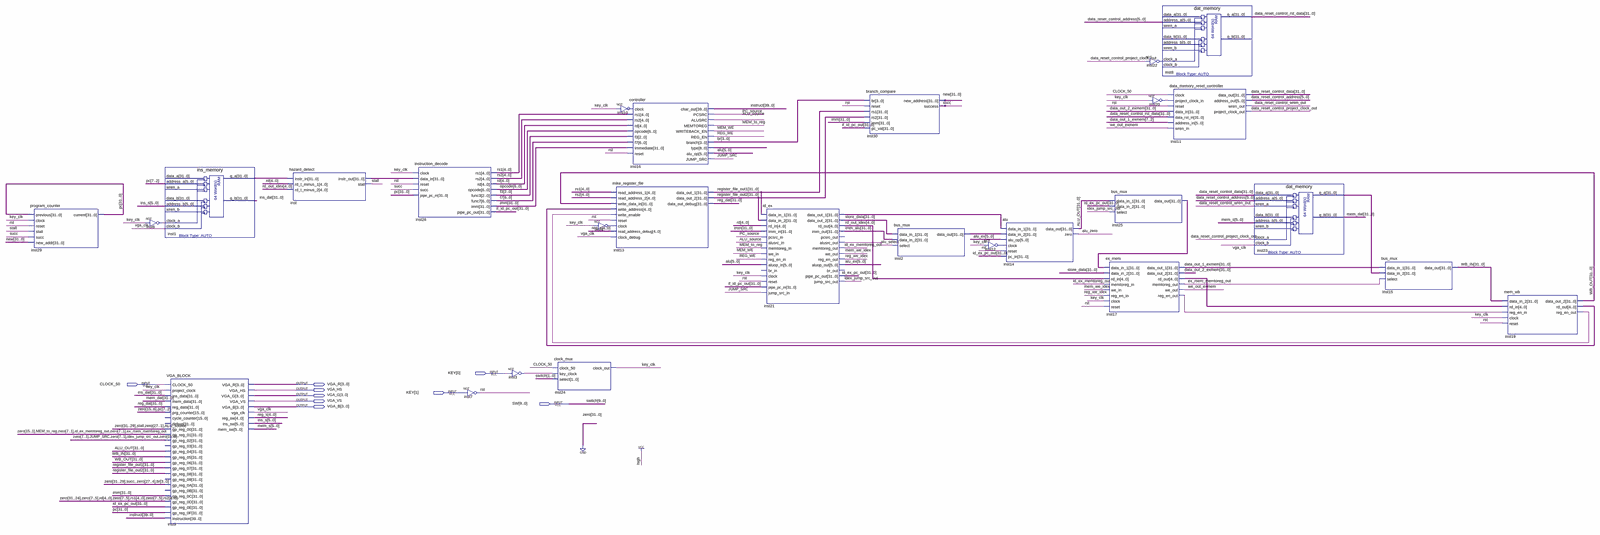
[diagram p0: schematic sheet, whole]
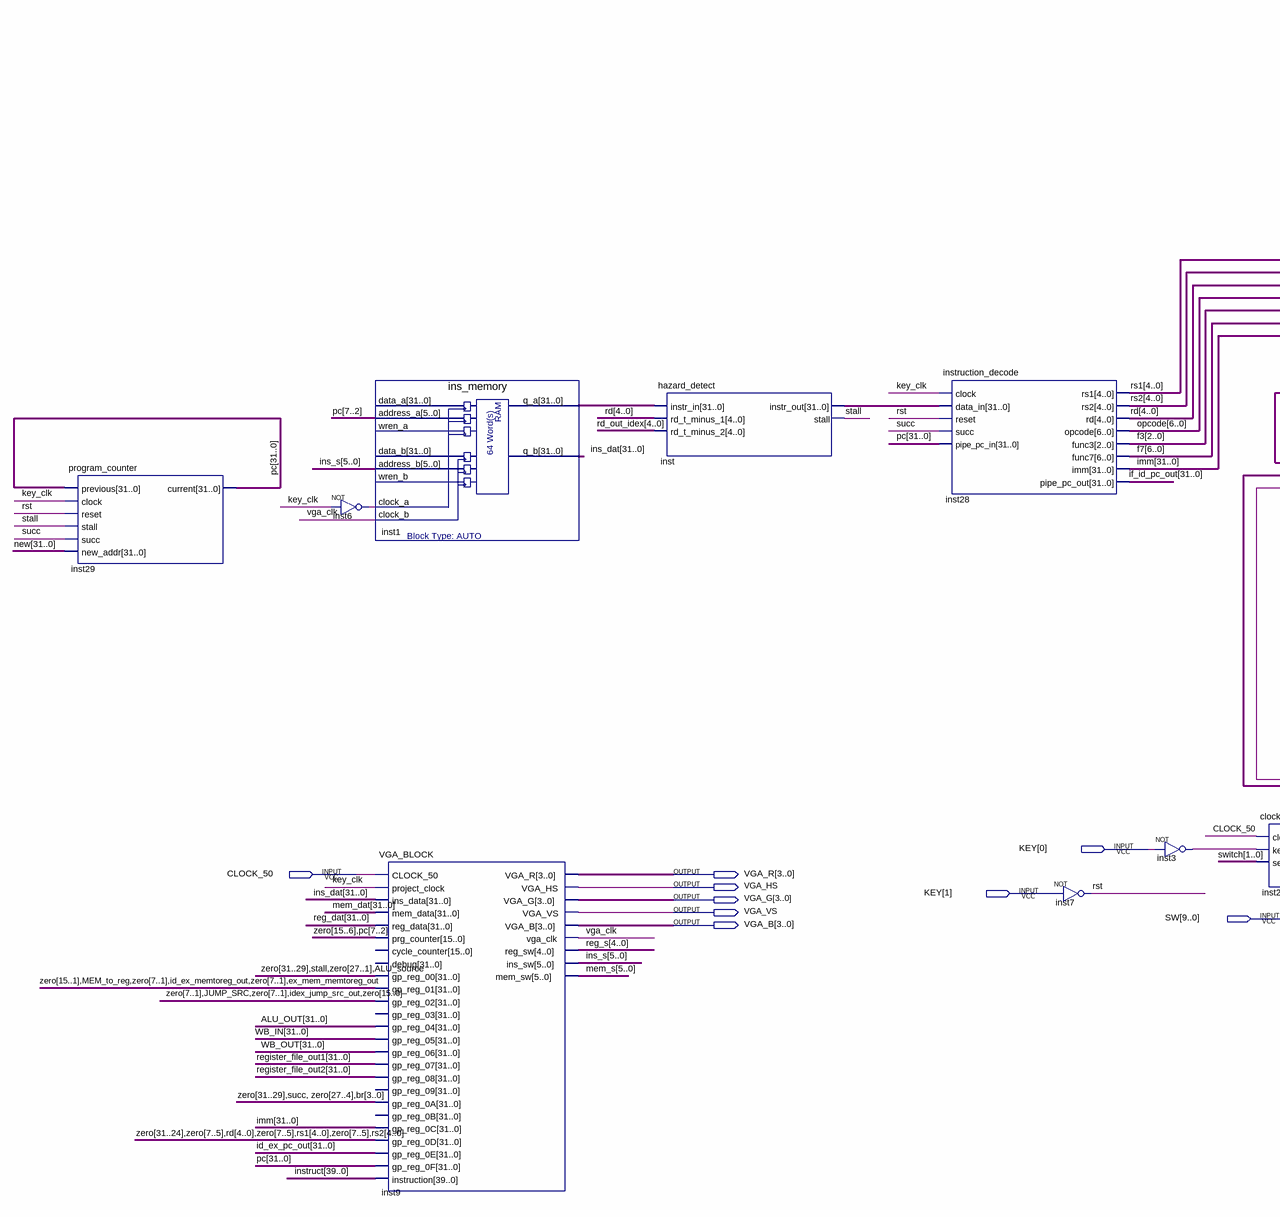
[diagram p1: schematic sheet, left part]
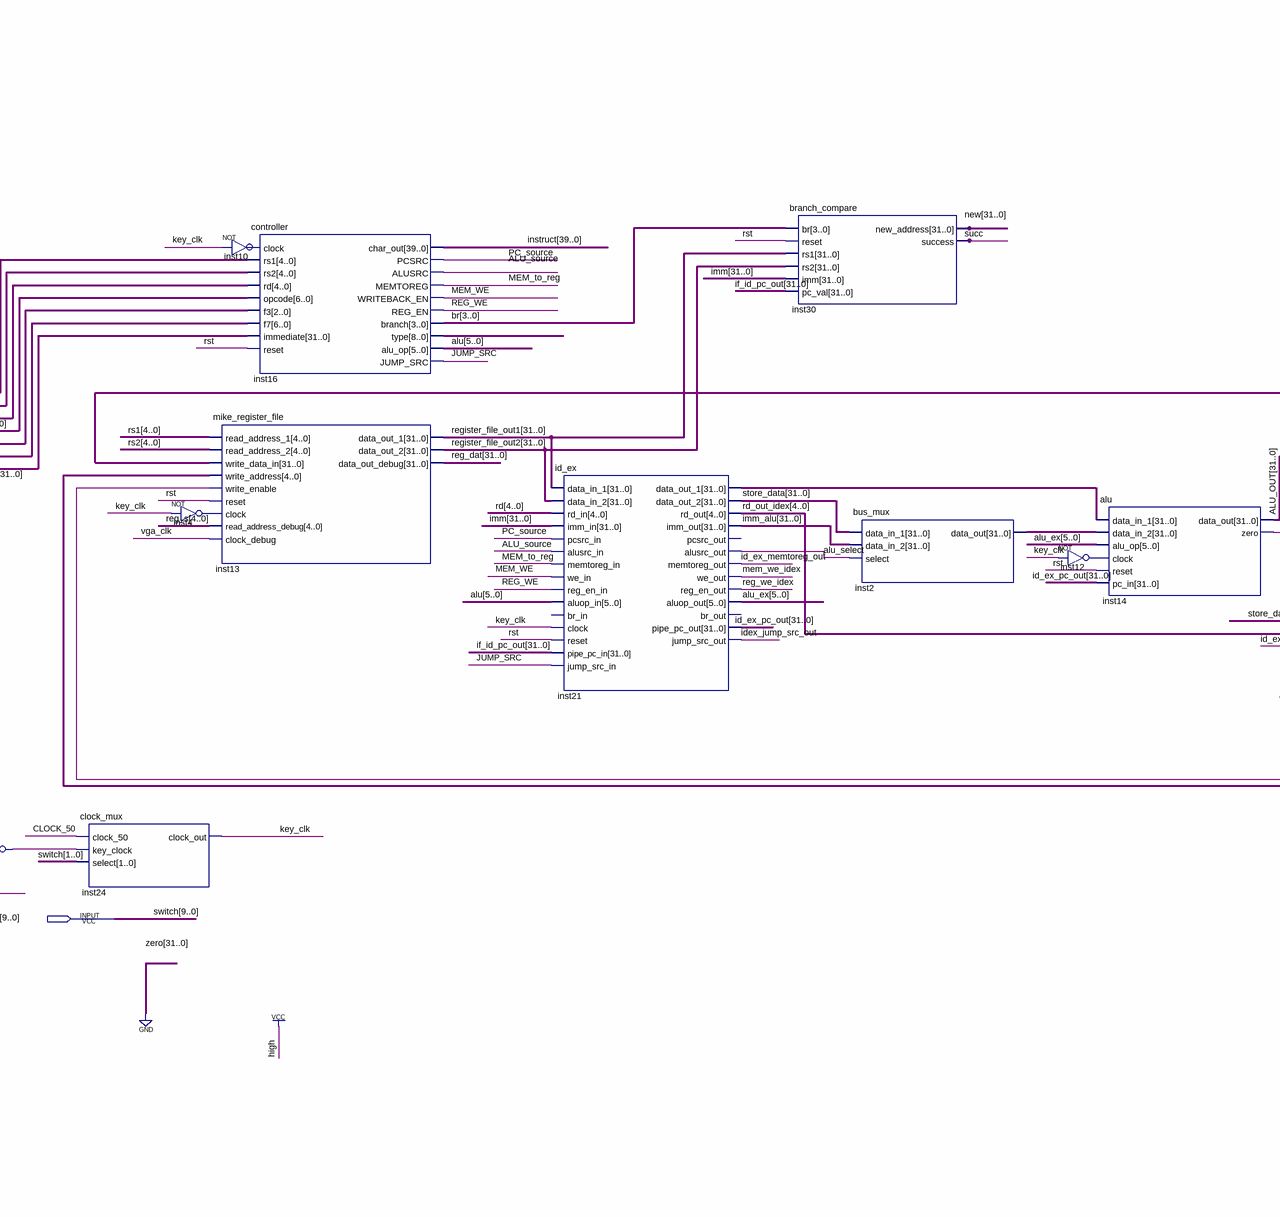
[diagram p2: schematic sheet, centre part]
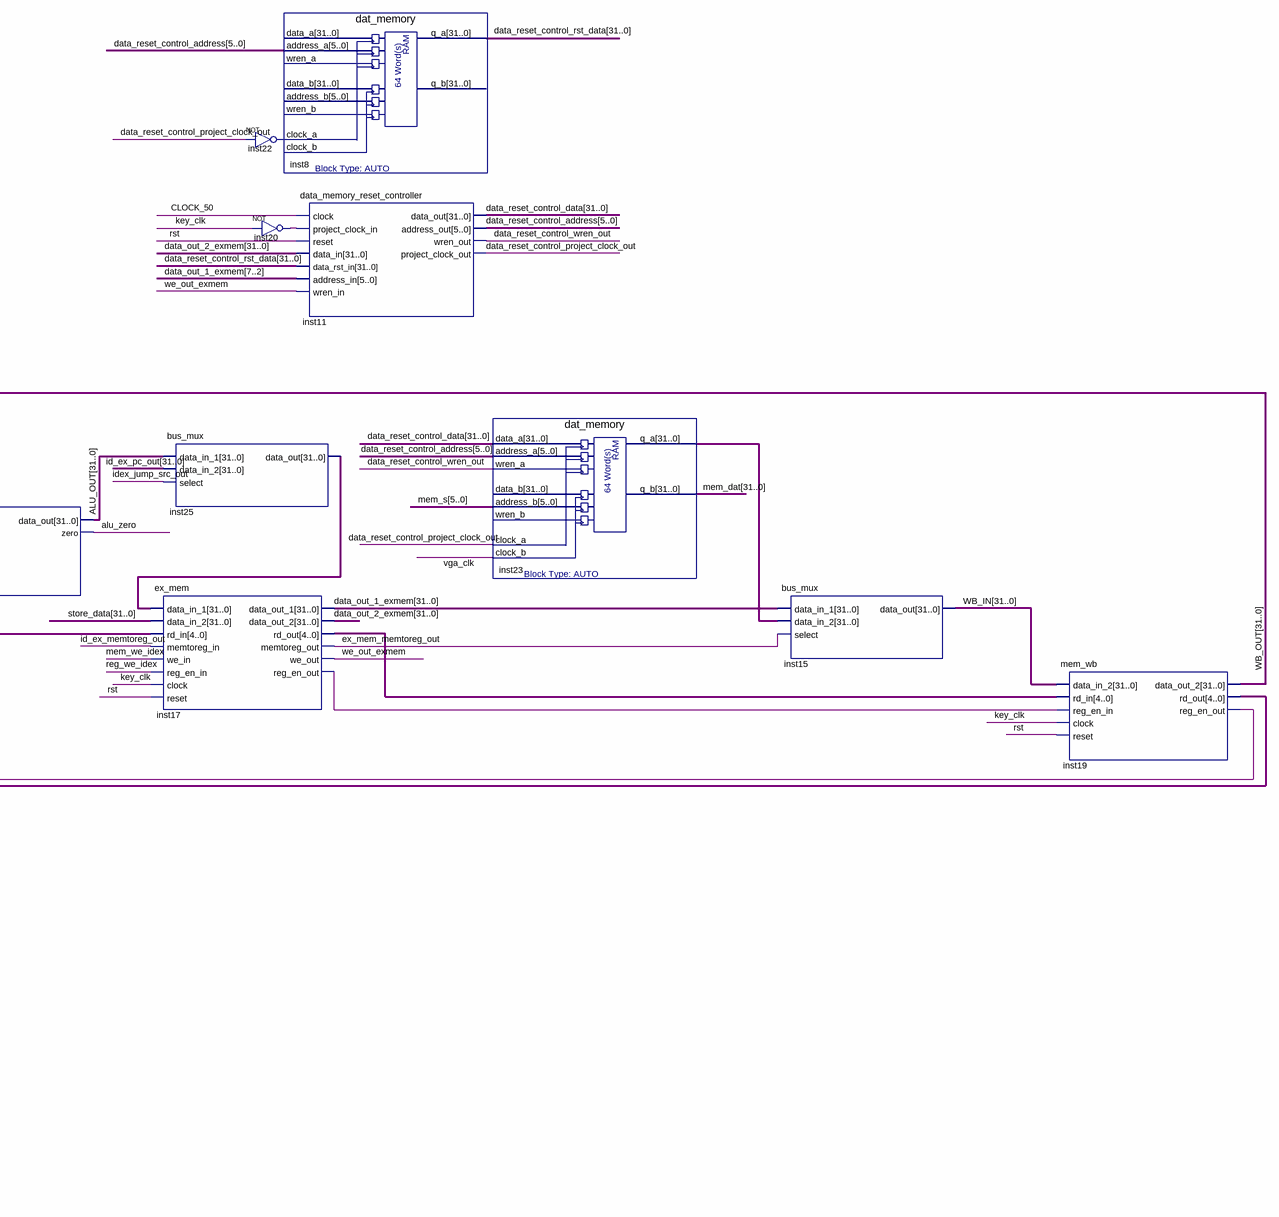
[diagram p3: schematic sheet, right part]
// Quartus schematic FiveStagePipeline.bdf as structural Verilog: 27 symbols, 9 pins
module FiveStagePipeline (
  input  [1:0] KEY,
  input  CLOCK_50,
  input  [9:0] SW,
  output [3:0] VGA_R,
  output VGA_HS,
  output [3:0] VGA_G,
  output VGA_VS,
  output [3:0] VGA_B
);

  wire alu_select, ALU_source, alu_zero, data_reset_control_project_clock_out, data_reset_control_wren_out,
       ex_mem_memtoreg_out, id_ex_memtoreg_out, idex_jump_src_out, inst3_out, inst4_out, inst6_out,
       inst10_out, inst12_out, inst17_reg_en_out, inst19_reg_en_out, inst20_out, inst22_out, JUMP_SRC,
       key_clk, MEM_to_reg, MEM_WE, mem_we_idex, PC_source, REG_WE, reg_we_idex, rst, stall, succ, vga_clk,
       we_out_exmem;
  wire [2:0] f3;
  wire [3:0] br;
  wire [4:0] inst17_rd_out, inst19_rd_out, rd, rd_out_idex, reg_s, rs1, rs2;
  wire [5:0] alu, alu_ex, data_reset_control_address, ins_s, mem_s;
  wire [6:0] f7, opcode;
  wire [8:0] inst16_type;
  wire [31:0] ALU_OUT, data_out_1_exmem, data_out_2_exmem, data_reset_control_data,
       data_reset_control_rst_data, id_ex_pc_out, if_id_pc_out, imm, imm_alu, ins_dat, inst1_q_a,
       inst2_data_out, inst21_data_out_1, inst23_q_a, inst25_data_out, inst_instr_out, mem_dat, \new , pc,
       reg_dat, register_file_out1, register_file_out2, store_data, WB_IN, WB_OUT;
  wire [39:0] instruct;

  program_counter inst29 (
    .previous(pc), .clock(key_clk), .reset(rst), .stall(stall), .succ(succ), .new_addr(\new ), .current(pc));
  not inst6 (inst6_out, key_clk);
  ins_memory inst1 (
    .address_a(pc[7:2]), .address_b(ins_s), .clock_a(inst6_out), .clock_b(vga_clk), .q_a(inst1_q_a),
    .q_b(ins_dat));  // open: data_a, wren_a, data_b, wren_b
  VGA_BLOCK inst9 (
    .CLOCK_50(CLOCK_50), .project_clock(key_clk), .ins_data(ins_dat), .mem_data(mem_dat), .reg_data(reg_dat),
    .prg_counter({{10{1'b0}}, pc[7:2]}), .gp_reg_00({3'b000, stall, {27{1'b0}}, ALU_source}),
    .gp_reg_01({{15{1'b0}}, MEM_to_reg, {7{1'b0}}, id_ex_memtoreg_out, {7{1'b0}}, ex_mem_memtoreg_out}),
    .gp_reg_02({{7{1'b0}}, JUMP_SRC, {7{1'b0}}, idex_jump_src_out, {16{1'b0}}}), .gp_reg_04(ALU_OUT),
    .gp_reg_05(WB_IN), .gp_reg_06(WB_OUT), .gp_reg_07(register_file_out1), .gp_reg_08(register_file_out2),
    .gp_reg_0A({3'b000, succ, {24{1'b0}}, br}), .gp_reg_0C(imm),
    .gp_reg_0D({{11{1'b0}}, rd, 3'b000, rs1, 3'b000, rs2}), .gp_reg_0E(id_ex_pc_out), .gp_reg_0F(pc),
    .instruction(instruct), .VGA_R(VGA_R), .VGA_HS(VGA_HS), .VGA_G(VGA_G), .VGA_VS(VGA_VS), .VGA_B(VGA_B),
    .vga_clk(vga_clk), .reg_sw(reg_s), .ins_sw(ins_s), .mem_sw(mem_s));  // open: cycle_counter, debug, gp_reg_03, gp_reg_09, gp_reg_0B
  hazard_detect inst (
    .instr_in(inst1_q_a), .rd_t_minus_1(rd), .rd_t_minus_2(rd_out_idex), .instr_out(inst_instr_out),
    .stall(stall));
  instruction_decode inst28 (
    .clock(key_clk), .data_in(inst_instr_out), .reset(rst), .succ(succ), .pipe_pc_in(pc), .rs1(rs1),
    .rs2(rs2), .rd(rd), .opcode(opcode), .func3(f3), .func7(f7), .imm(imm), .pipe_pc_out(if_id_pc_out));
  not inst7 (rst, KEY[1]);
  not inst3 (inst3_out, KEY[0]);
  clock_mux inst24 (.clock_50(CLOCK_50), .key_clock(inst3_out), .select(SW[1:0]), .clock_out(key_clk));
  not inst4 (inst4_out, key_clk);
  not inst10 (inst10_out, key_clk);
  mike_register_file inst13 (
    .read_address_1(rs1), .read_address_2(rs2), .write_data_in(WB_OUT), .write_address(inst19_rd_out),
    .write_enable(inst19_reg_en_out), .reset(rst), .clock(inst4_out), .read_address_debug(reg_s),
    .clock_debug(vga_clk), .data_out_1(register_file_out1), .data_out_2(register_file_out2),
    .data_out_debug(reg_dat));
  controller inst16 (
    .clock(inst10_out), .rs1(rs1), .rs2(rs2), .rd(rd), .opcode(opcode), .f3(f3), .f7(f7), .immediate(imm),
    .reset(rst), .char_out(instruct), .PCSRC(PC_source), .ALUSRC(ALU_source), .MEMTOREG(MEM_to_reg),
    .WRITEBACK_EN(MEM_WE), .REG_EN(REG_WE), .branch(br), .\type (inst16_type), .alu_op(alu),
    .JUMP_SRC(JUMP_SRC));
  id_ex inst21 (
    .data_in_1(register_file_out1), .data_in_2(register_file_out2), .rd_in(rd), .imm_in(imm),
    .pcsrc_in(PC_source), .alusrc_in(ALU_source), .memtoreg_in(MEM_to_reg), .we_in(MEM_WE),
    .reg_en_in(REG_WE), .aluop_in(alu), .clock(key_clk), .reset(rst), .pipe_pc_in(if_id_pc_out),
    .jump_src_in(JUMP_SRC), .data_out_1(inst21_data_out_1), .data_out_2(store_data), .rd_out(rd_out_idex),
    .imm_out(imm_alu), .alusrc_out(alu_select), .memtoreg_out(id_ex_memtoreg_out), .we_out(mem_we_idex),
    .reg_en_out(reg_we_idex), .aluop_out(alu_ex), .pipe_pc_out(id_ex_pc_out), .jump_src_out(idex_jump_src_out));  // open: br_in, pcsrc_out, br_out
  branch_compare inst30 (
    .br(br), .reset(rst), .rs1(register_file_out1), .rs2(register_file_out2), .imm(imm),
    .pc_val(if_id_pc_out), .new_address(\new ), .success(succ));
  bus_mux inst2 (.data_in_1(store_data), .data_in_2(imm_alu), .select(alu_select), .data_out(inst2_data_out));
  not inst12 (inst12_out, key_clk);
  alu inst14 (
    .data_in_1(inst21_data_out_1), .data_in_2(inst2_data_out), .alu_op(alu_ex), .clock(inst12_out),
    .reset(rst), .pc_in(id_ex_pc_out), .data_out(ALU_OUT), .zero(alu_zero));
  bus_mux inst25 (
    .data_in_1(ALU_OUT), .data_in_2(id_ex_pc_out), .select(idex_jump_src_out), .data_out(inst25_data_out));
  ex_mem inst17 (
    .data_in_1(inst25_data_out), .data_in_2(store_data), .rd_in(rd_out_idex),
    .memtoreg_in(id_ex_memtoreg_out), .we_in(mem_we_idex), .reg_en_in(reg_we_idex), .clock(key_clk),
    .reset(rst), .data_out_1(data_out_1_exmem), .data_out_2(data_out_2_exmem), .rd_out(inst17_rd_out),
    .memtoreg_out(ex_mem_memtoreg_out), .we_out(we_out_exmem), .reg_en_out(inst17_reg_en_out));
  not inst22 (inst22_out, data_reset_control_project_clock_out);
  not inst20 (inst20_out, key_clk);
  dat_memory inst8 (
    .address_a(data_reset_control_address), .clock_a(inst22_out), .q_a(data_reset_control_rst_data));  // open: data_a, wren_a, data_b, address_b, wren_b, clock_b, q_b
  data_memory_reset_controller inst11 (
    .clock(CLOCK_50), .project_clock_in(inst20_out), .reset(rst), .data_in(data_out_2_exmem),
    .data_rst_in(data_reset_control_rst_data), .address_in(data_out_1_exmem[7:2]), .wren_in(we_out_exmem),
    .data_out(data_reset_control_data), .address_out(data_reset_control_address),
    .wren_out(data_reset_control_wren_out), .project_clock_out(data_reset_control_project_clock_out));
  dat_memory inst23 (
    .data_a(data_reset_control_data), .address_a(data_reset_control_address),
    .wren_a(data_reset_control_wren_out), .address_b(mem_s), .clock_a(data_reset_control_project_clock_out),
    .clock_b(vga_clk), .q_a(inst23_q_a), .q_b(mem_dat));  // open: data_b, wren_b
  bus_mux inst15 (.data_in_1(data_out_1_exmem), .data_in_2(inst23_q_a), .select(ex_mem_memtoreg_out), .data_out(WB_IN));
  mem_wb inst19 (
    .data_in_2(WB_IN), .rd_in(inst17_rd_out), .reg_en_in(inst17_reg_en_out), .clock(key_clk), .reset(rst),
    .data_out_2(WB_OUT), .rd_out(inst19_rd_out), .reg_en_out(inst19_reg_en_out));

  // Other names for the same wires on the sheet: switch[9:0] = SW
endmodule
